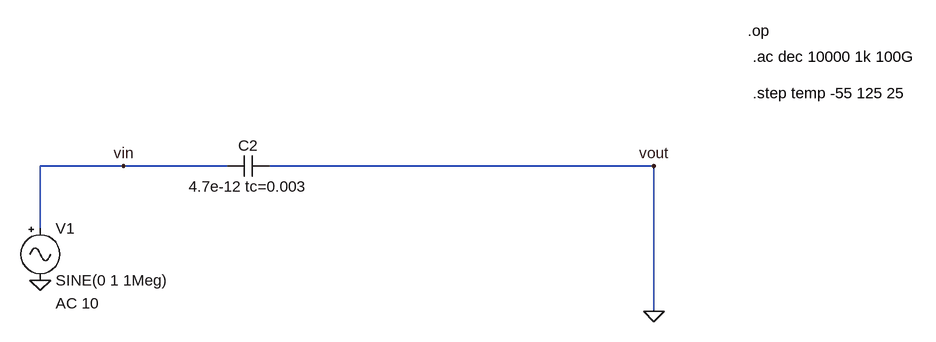
[diagram p0: schematic Draft1.asc]
Draft1.asc, the LTspice schematic file:
Version 4
SHEET 1 1360 680
WIRE 96 64 -32 64
WIRE 256 64 96 64
WIRE 912 64 320 64
WIRE -32 160 -32 64
WIRE 912 288 912 64
FLAG -32 240 0
FLAG 912 288 0
FLAG 96 64 vin
FLAG 912 64 vout
SYMBOL Misc\\signal -32 144 R0
WINDOW 123 24 132 Left 2
WINDOW 39 0 0 Left 0
SYMATTR InstName V1
SYMATTR Value SINE(0 1 1Meg)
SYMATTR Value2 AC 10
SYMBOL cap 320 48 R90
WINDOW 0 0 32 VBottom 2
WINDOW 3 32 32 VTop 2
SYMATTR InstName C2
SYMATTR Value 4.7e-12 tc=0.003
SYMATTR SpiceLine V=4 Irms=1 Rser=0.3711 Lser=0.28e-9 Rpar=10e9
TEXT 1056 -144 Left 2 !.op
TEXT 1064 -104 Left 2 !.ac dec 10000 1k 100G
TEXT 1064 -48 Left 2 !.step temp -55 125 25

The netlist it stands for:
* Draft1.asc
V1 vin 0 SINE(0 1 1Meg) AC 10
C2 0 vin 4.7e-12 tc=0.003 V=4 Irms=1 Rser=0.3711 Lser=0.28e-9 Rpar=10e9
.op
.ac dec 10000 1k 100G
.step temp -55 125 25
.backanno
.end